# EasyEDA Pro project ProPrj_332G_2025-04-08_13-48-16_2025-05-20.epro

# Schematic Schematic1
Board Name: Board1; Create Date: 2025-04-08; Page Name: P1; Project Name: 332G_2025-04-08_13-48-16; Schematic Name: Schematic1; Update Date: 2025-04-08; Company: 嘉立创EDA; Page Size: A4; Version: V1.0
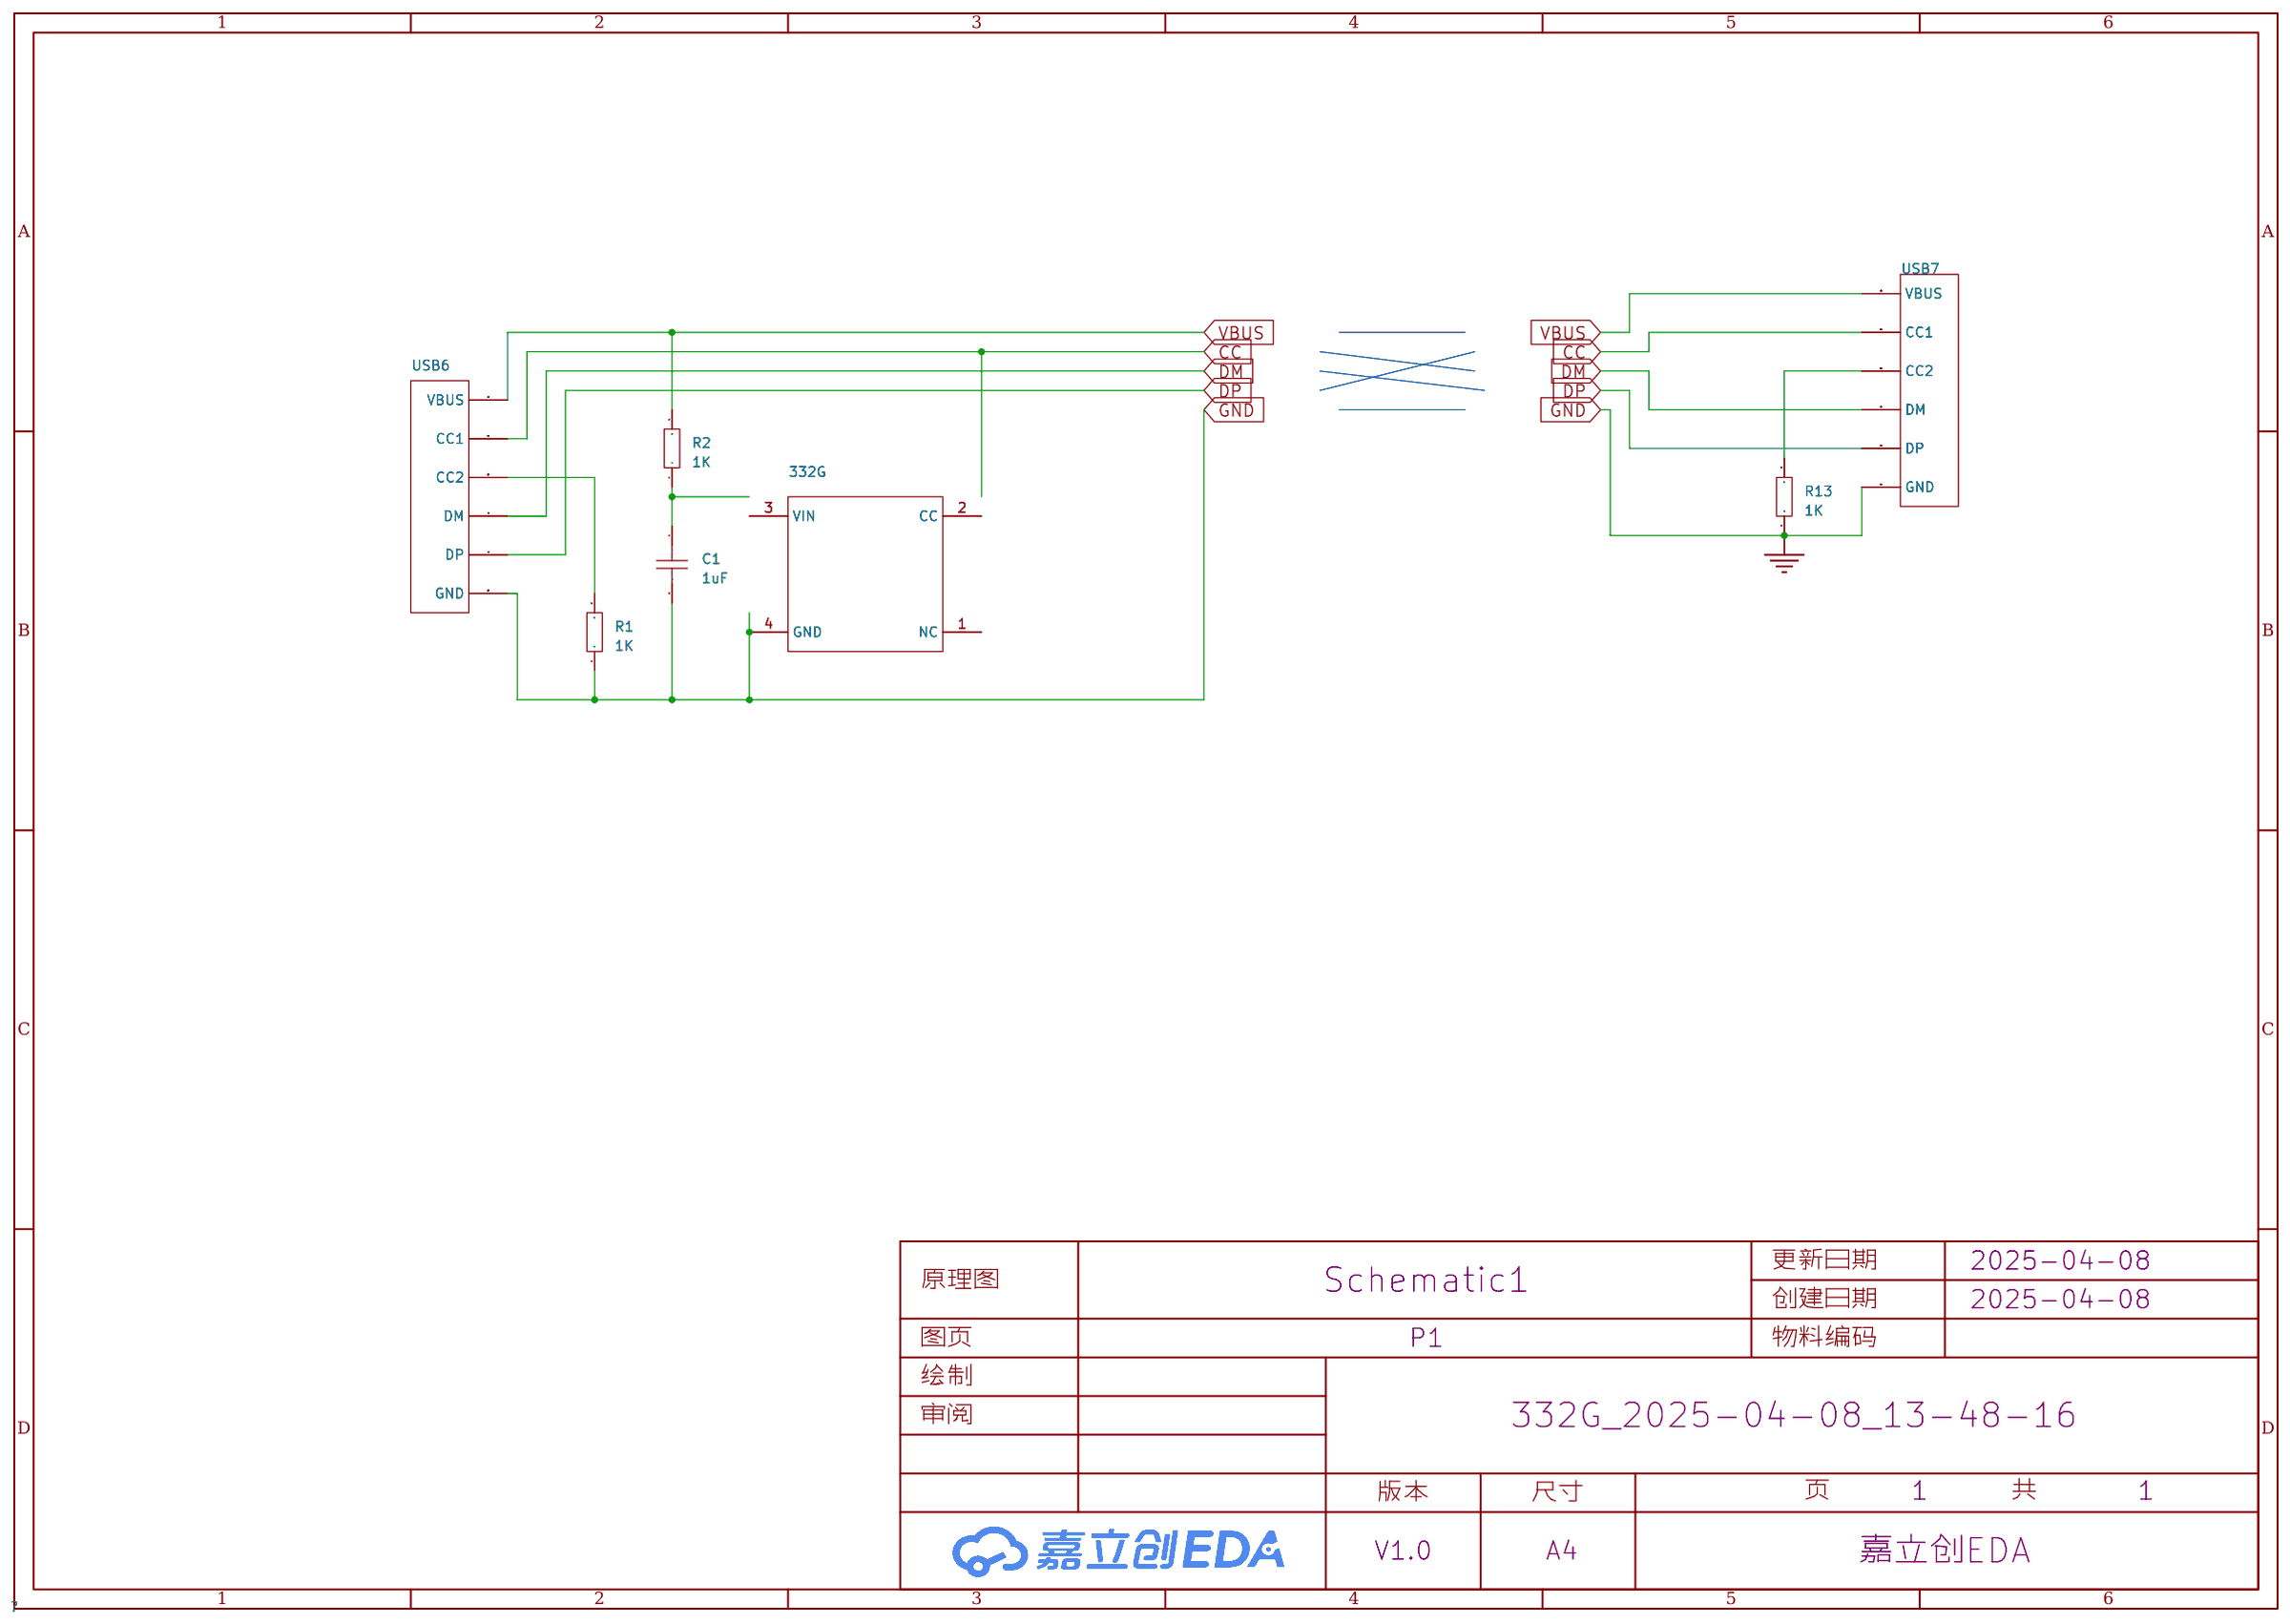
[diagram p0: schematic sheet]

## Parts
332G  -  [ODFN-4_L1.6-W1.6]
C1  1uF  [0603C]
R1  1K  [0603R]
R2  1K  [R0603]
R13  1K  [0603R]
USB6  -  [TYPE-C14P]
USB7  -  [TYPE-C14P]

## Library data of the parts
332G = 332G
C1 = 1uF
R1 R13 = 10K
R2 = Res_0603: Supplier Footprint: 0603
USB6 USB7 = TYPEC-14PIN(公头）

## Nets
GND: 332G.4(GND) C1.2 R1.1 R13.1 USB6.GND USB7.GND
VBUS: R2.2 USB6.VBUS USB7.VBUS
CC: USB6.CC1 USB7.CC1
DM: USB6.DM USB7.DM
DP: USB6.DP USB7.DP
$1N410: R1.2 USB6.CC2
Net-(C1-1): C1.1 R2.1
Net-(R13-2): R13.2 USB7.CC2

Not connected (* = marked no-connect by the designer): 332G 1(NC) 2(CC) 3(VIN)

# Board PCB1
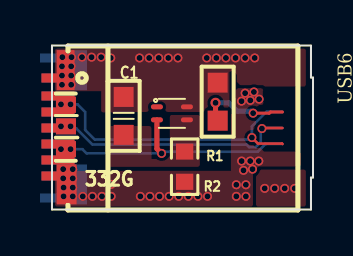
[diagram p1: board, top side]
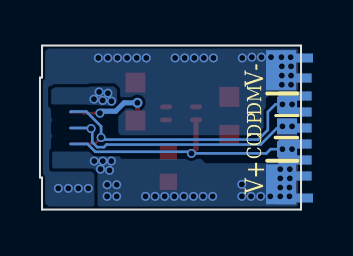
[diagram p2: board, bottom side, seen from below]

Outline 13.06 x 8.2 mm; copper layers: Top Layer, Bottom Layer. Coordinates in mm from the lower left corner of the outline.
Outline path: 0,8.2 0,0 12.95,0 12.95,1.6 13.06,1.6 13.06,6.6 12.95,6.6 12.95,8.2 0,8.2
Stack: Top Layer 0.035mm / Dielectric1 1.51mm FR4 er 4.5 / Bottom Layer 0.035mm

## Design rules (mm)
template: 自定义配置
spacing copperThickness1oz (default): track to track 0.102, other pairs 0.152 to 0.3
spacing copperThickness2oz: track to track 0.203, other pairs 0.152 to 0.3
track width copperThickness1oz (default): min 0.127, default 0.254, max 2.54
track width copperThickness2oz: min 0.203, default 0.254, max 2.54
differential pair differentialPair (default): width min 0.127, default 0.254, max 2.54; gap min 0.152, default 0.152
via viaSize (default): diameter min 0.5, default 0.61, max 10; hole min 0.3, default 0.305, max 6.3

## Placement (name value [footprint] x y rotation side)
332G  -  [ODFN-4_L1.6-W1.6]  6 4.81 180 top
C1  1uF  [0603C]  3.59 4.68 90 top
NOREF  -  [Pad_e156]  0.7 4.16 270 top
NOREF#2  -  [Pad_e161]  0.7 4.16 270 top
NOREF#3  -  [Pad_e159]  0.7 3.02 270 top
NOREF#4  -  [Pad_e158]  0.73 1.26 270 top
NOREF#5  -  [Pad_e154]  0.68 6.97 270 top
NOREF#6  -  [Pad_e157]  0.7 5.24 270 top
NOREF#7  -  [Pad_e163]  1 1.26 270 top
NOREF#8  -  [Pad_e155]  0.7 3.02 270 top
NOREF#9  -  [Pad_e160]  0.7 5.24 270 top
NOREF#10  -  [Pad_e162]  1 6.97 270 top
R1  1K  [0603R]  8.29 5.44 270 top
R2  1K  [R0603]  6.64 2.14 270 top
USB6  -  [TYPE-C14P]  11.53 4.08 270 top

## Footprints (pads in the part's own frame, mm; a bottom-side part is the same pattern mirrored in y, then rotated)
0603C
  rect 1x1 smd: 1(-0.95,0) 2(0.95,0)
0603R
  rect 1x1 smd: 1(-0.9,0) 2(1,0)
ODFN-4_L1.6-W1.6
  oval 0.6x0.25 smd: 1(0.75,-0.325) 2(0.75,0.325) 3(-0.75,0.325) 4(-0.75,-0.325)
Pad_e154
  rect 2x0.9 smd: 7(0,0)
Pad_e155
  rect 0.8x1 smd: 7(0,0)
Pad_e156
  rect 0.8x1 smd: 7(0,0)
Pad_e157
  rect 0.8x1 smd: 7(0,0)
Pad_e158
  rect 2x1 smd: 7(0,0)
Pad_e159
  rect 0.8x1 smd far side: 7(0,0)
Pad_e160
  rect 0.8x1 smd far side: 7(0,0)
Pad_e161
  rect 0.8x1 smd far side: 7(0,0)
Pad_e162
  rect 2x1.5 smd far side: 7(0,0)
Pad_e163
  rect 2x1.5 smd far side: 7(0,0)
R0603
  rect 0.806x0.864 smd: 1(-0.753,0) 2(0.753,0)
TYPE-C14P
  rect 0.45x1.65 smd far side: CC1(0.8,-11.227) DM(-0.8,-11.227) DP(0,-11.227) GND(-2.5,-11.227) GND(2.4,-11.227) VBUS(-1.6,-11.227) VBUS(1.6,-11.227)
  rect 0.45x1.65 smd: CC2(-0.8,-11.227) DM(0.8,-11.227) DP(0,-11.227) GND(-2.5,-11.227) GND(2.4,-11.227) VBUS(-1.6,-11.227) VBUS(1.6,-11.227)
  rect 0.45x1.8 smd far side: GND(-3.5,-11.227) GND(3.5,-11.227)

## Nets
GND1: 332G.4 C1.2 NOREF#5.7 NOREF#10.7 R1.1 USB6.GND
VBUS1: NOREF#4.7 NOREF#7.7 R2.2 USB6.VBUS
CC: 332G.2 NOREF#3.7 NOREF#8.7 USB6.CC1
DM: NOREF#6.7 NOREF#9.7 USB6.DM
DP: NOREF.7 NOREF#2.7 USB6.DP
$1N410: R1.2 USB6.CC2
$1N950: 332G.3 C1.1 R2.1

Pads without a net: 332G 1

## Via types
v1: diameter 0.45, hole 0.3, Top Layer to Bottom Layer, 72 vias
v2: diameter 0.5, hole 0.3, Top Layer to Bottom Layer, 1 via

## Routing (per net, layer and track width the routed paths; a pad name or vN(x,y) marks a point on that pad's centre or on a via; arc(x,y) is an arc through that point)
GND1:
  vias: v1(0.52,7.62) v1(0.5,7.16) v1(0.5,6.7) v1(0.5,6.24) v1(0.96,7.16) v1(0.96,6.7) v1(0.96,6.24) v1(0.98,7.62) v1(1.5,7.62) v1(1.98,7.62) v1(2.46,7.62) v1(2.94,7.58) v1(4.38,7.58) v1(4.86,7.58) v1(5.34,7.58) v1(5.82,7.58) v1(6.3,7.58) v1(7.74,7.58) v1(8.22,7.58) v1(8.7,7.58) v1(9.18,7.58) v1(9.66,7.58) v1(10.14,7.58) v1(10.64,1.06) v1(11.14,1.06) v1(11.64,1.06) v1(12.14,1.06)
VBUS1:
  vias: v1(0.56,2.02) v1(0.56,1.56) v1(0.58,1.1) v1(0.58,0.66) v1(1.04,2.02) v1(1.04,1.56) v1(1.04,1.1) v1(1.04,0.66) v1(1.54,0.66) v1(2.02,0.66) v1(2.5,0.66) v1(2.96,1.26) v1(2.96,0.66) v1(4.42,0.66) v1(4.9,0.66) v1(5.38,0.66) v1(5.86,0.66) v1(6.34,0.66) v1(6.82,0.66) v1(7.3,0.66) v1(7.78,0.66) v1(9.22,1.24) v1(9.22,0.66) v1(9.48,5.42) v1(9.48,2.42) v1(9.66,5.82) v1(9.58,1.96) v1(9.7,1.24) v1(9.7,0.66) v1(9.92,5.46) v1(9.91,2.42) v1(10.03,2.02) v1(10.1,5.88) v1(10.36,5.52) v1(10.34,2.42)
CC: length 12.9
  Top Layer w0.254: 332G.2 5.25,3.04 v1(5.48,2.81)
  Bottom Layer w0.13: 11.53,3.28 10.68,3.28 10.29,2.89 5.56,2.89 v1(5.48,2.81) 1.73,2.81 1.52,3.02 v1(0.93,3.02) NOREF#3.7
  vias: v1(0.45,3.02)
DM: length 14.7
  Top Layer w0.13: v1(10,3.6) 10.3,3.3 11.51,3.3 11.53,3.28
  Bottom Layer w0.13: NOREF#6.7 0.72,5.26 v1(0.93,5.26) 1.28,5.26 1.66,4.88 1.66,3.98 2.14,3.5 9.9,3.5 v1(10,3.6) 10,4.16 10.74,4.9 11.51,4.9 11.53,4.88
  vias: v1(0.45,5.26)
DP: length 13.1
  Top Layer w0.13: 11.53,4.08 10.53,4.08 v1(10.5,4.05)
  Bottom Layer w0.13: NOREF.7 v1(0.93,4.16) 1.03,4.06 1.21,4.06 2.02,3.25 9.73,3.25 9.86,3.12 10.19,3.12 10.44,3.37 10.44,4.02 10.49,4.06 ; 10.49,4.06 v1(10.5,4.05) ; 10.49,4.06 10.47,4.08 11.53,4.08
  vias: v1(0.45,4.16)
$1N410: length 4.5
  Top Layer w0.15: v1(10.06,4.82) 10.87,4.82 10.93,4.88 11.53,4.88
  Top Layer w0.254: v2(8.18,5.34) 8.18,4.55 R1.2
  Bottom Layer w0.254: v2(8.18,5.34) 8.85,5.34 9.27,4.92 9.96,4.92 v1(10.06,4.82)

## Copper pours and planes (outline as drawn; the poured copper is in the pictures)
GND1 on Top Layer: 12.66,8.2 12.7,8.16 12.7,6.15 10.63,6.15 10.56,6.22 9.4,6.22 9.24,6.38 9.24,6.73 9.07,6.9 8.88,6.9 8.88,4.88 4.68,4.88 2.46,4.86 2.46,5.92 0,5.92 0,8.2
GND1 on Top Layer: 12.7,0 10.21,0 10.21,1.83 10.38,2 12.7,2
GND1 on Bottom Layer: 12.7,0.24 12.7,0 10.21,0 10.21,1.83 10.38,2 11.09,2 11.09,6.15 9.31,6.15 9.14,5.98 9.14,3.84 8.96,3.66 1.96,3.66 1.76,3.86 1.76,5.56 1.4,5.92 0,5.92 0,8.2 12.7,8.2 12.7,7.98 12.86,7.98 12.95,7.89 12.95,0.24
VBUS1 on Top Layer: 0,0 0,1.94 8.95,1.94 8.95,5.37 9.2,5.62 9.2,5.98 9.36,6.14 10.56,6.14 10.65,6.05 12.5,6.05 12.5,5.23 10.35,5.23 10.35,3.15 10.6,2.9 12.45,2.9 12.45,2.05 10.39,2.05 10.18,1.84 10.18,0.01 10.17,0
VBUS1 on Bottom Layer: 9.46,6.12 12.31,6.12 12.48,5.95 12.48,5.32 9.3,5.32 9.3,5.96
VBUS1 on Bottom Layer: 12.5,6.05 10.67,6.05 10.56,6.16 9.36,6.16 9.2,6 9.2,5.5 9.15,5.45 9.15,4.94 9.85,4.94 10.14,5.23 12.5,5.23
VBUS1 on Bottom Layer: 10.48,2.78 10.6,2.9 12.45,2.9 12.45,2.05 10.39,2.05 10.18,1.84 10.18,0.01 0.01,0.01 0,0 0,2.32 4.78,2.32 4.99,2.53 9.02,2.53 9.02,2.72 9.08,2.78
DM1 on Top Layer: 1.28,4.79 0.13,4.79 0.13,5.7 1.28,5.7
DM1 on Bottom Layer: 1.5,5 1.29,4.79 0.13,4.79 0.13,5.7 1.31,5.7 1.5,5.5
DP1 on Top Layer: 1.28,3.71 0.13,3.71 0.13,4.62 1.28,4.62
DP1 on Bottom Layer: 1.5,3.92 1.29,3.71 0.13,3.71 0.13,4.62 1.31,4.62 1.5,4.42
$1N666 on Top Layer: 1.28,2.57 0.13,2.57 0.13,3.48 1.28,3.48
$1N666 on Bottom Layer: 1.5,2.78 1.29,2.57 0.13,2.57 0.13,3.48 1.31,3.48 1.5,3.28
$1N950 on Top Layer: 2.79,4.17 2.79,2.14 7.4,2.14 7.4,4.68 7.52,4.81 5.9,4.81 5.9,2.67 5.75,2.52 4.98,2.52 4.98,4.17

## Text on the board
Bottom Silkscreen Layer: DM | DP | CC | V- | V+
Top Silkscreen Layer: C1
